# EAGLE design sanguino_better_both (EAGLE 5.10)
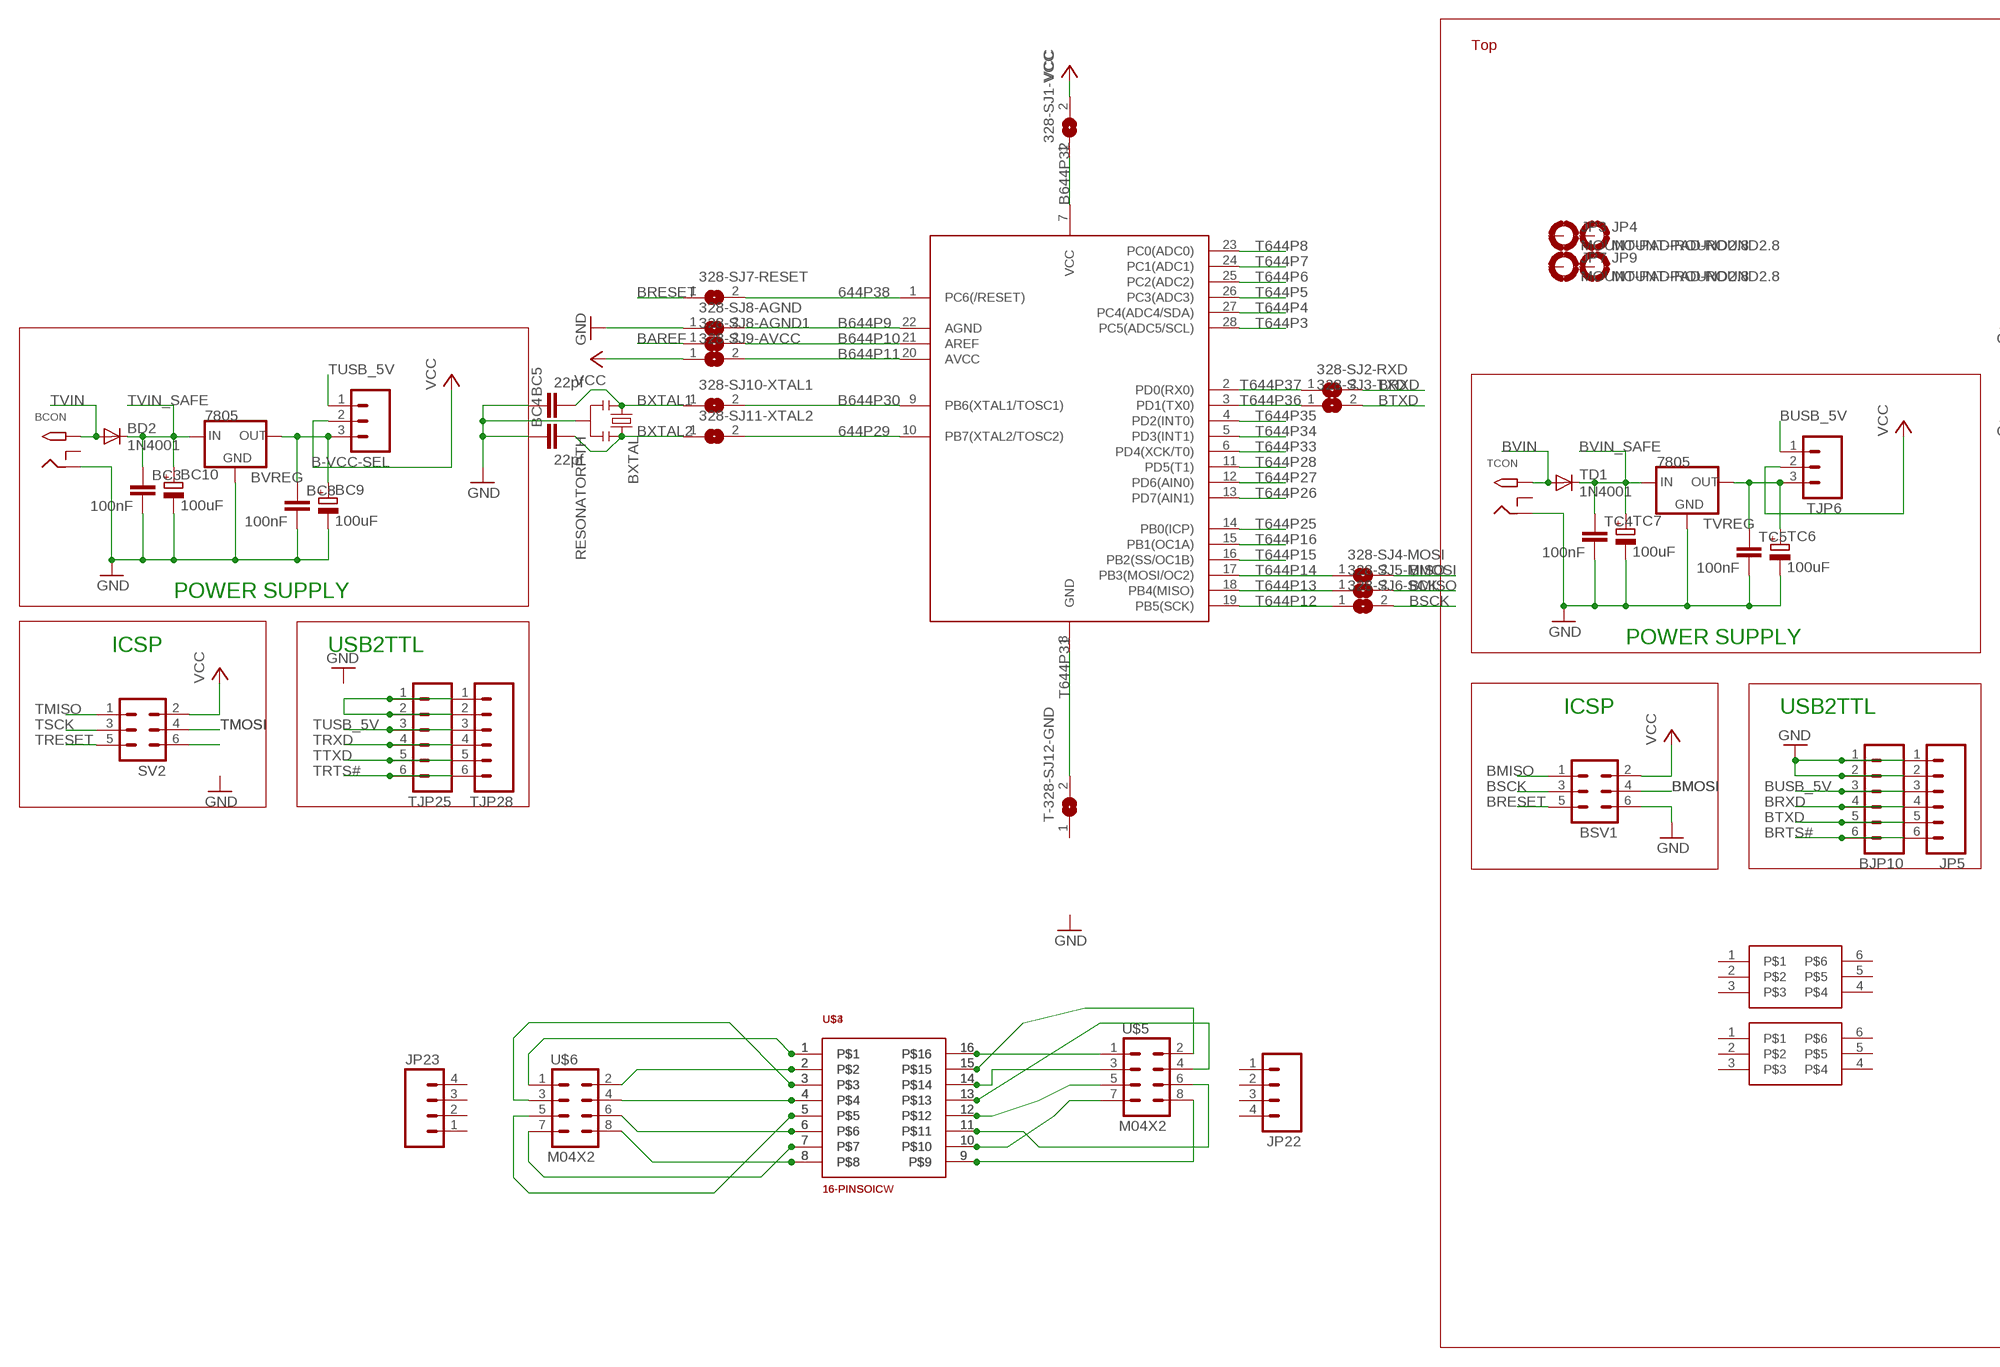
[diagram p0: schematic, sheet 1, part 1 of 2]
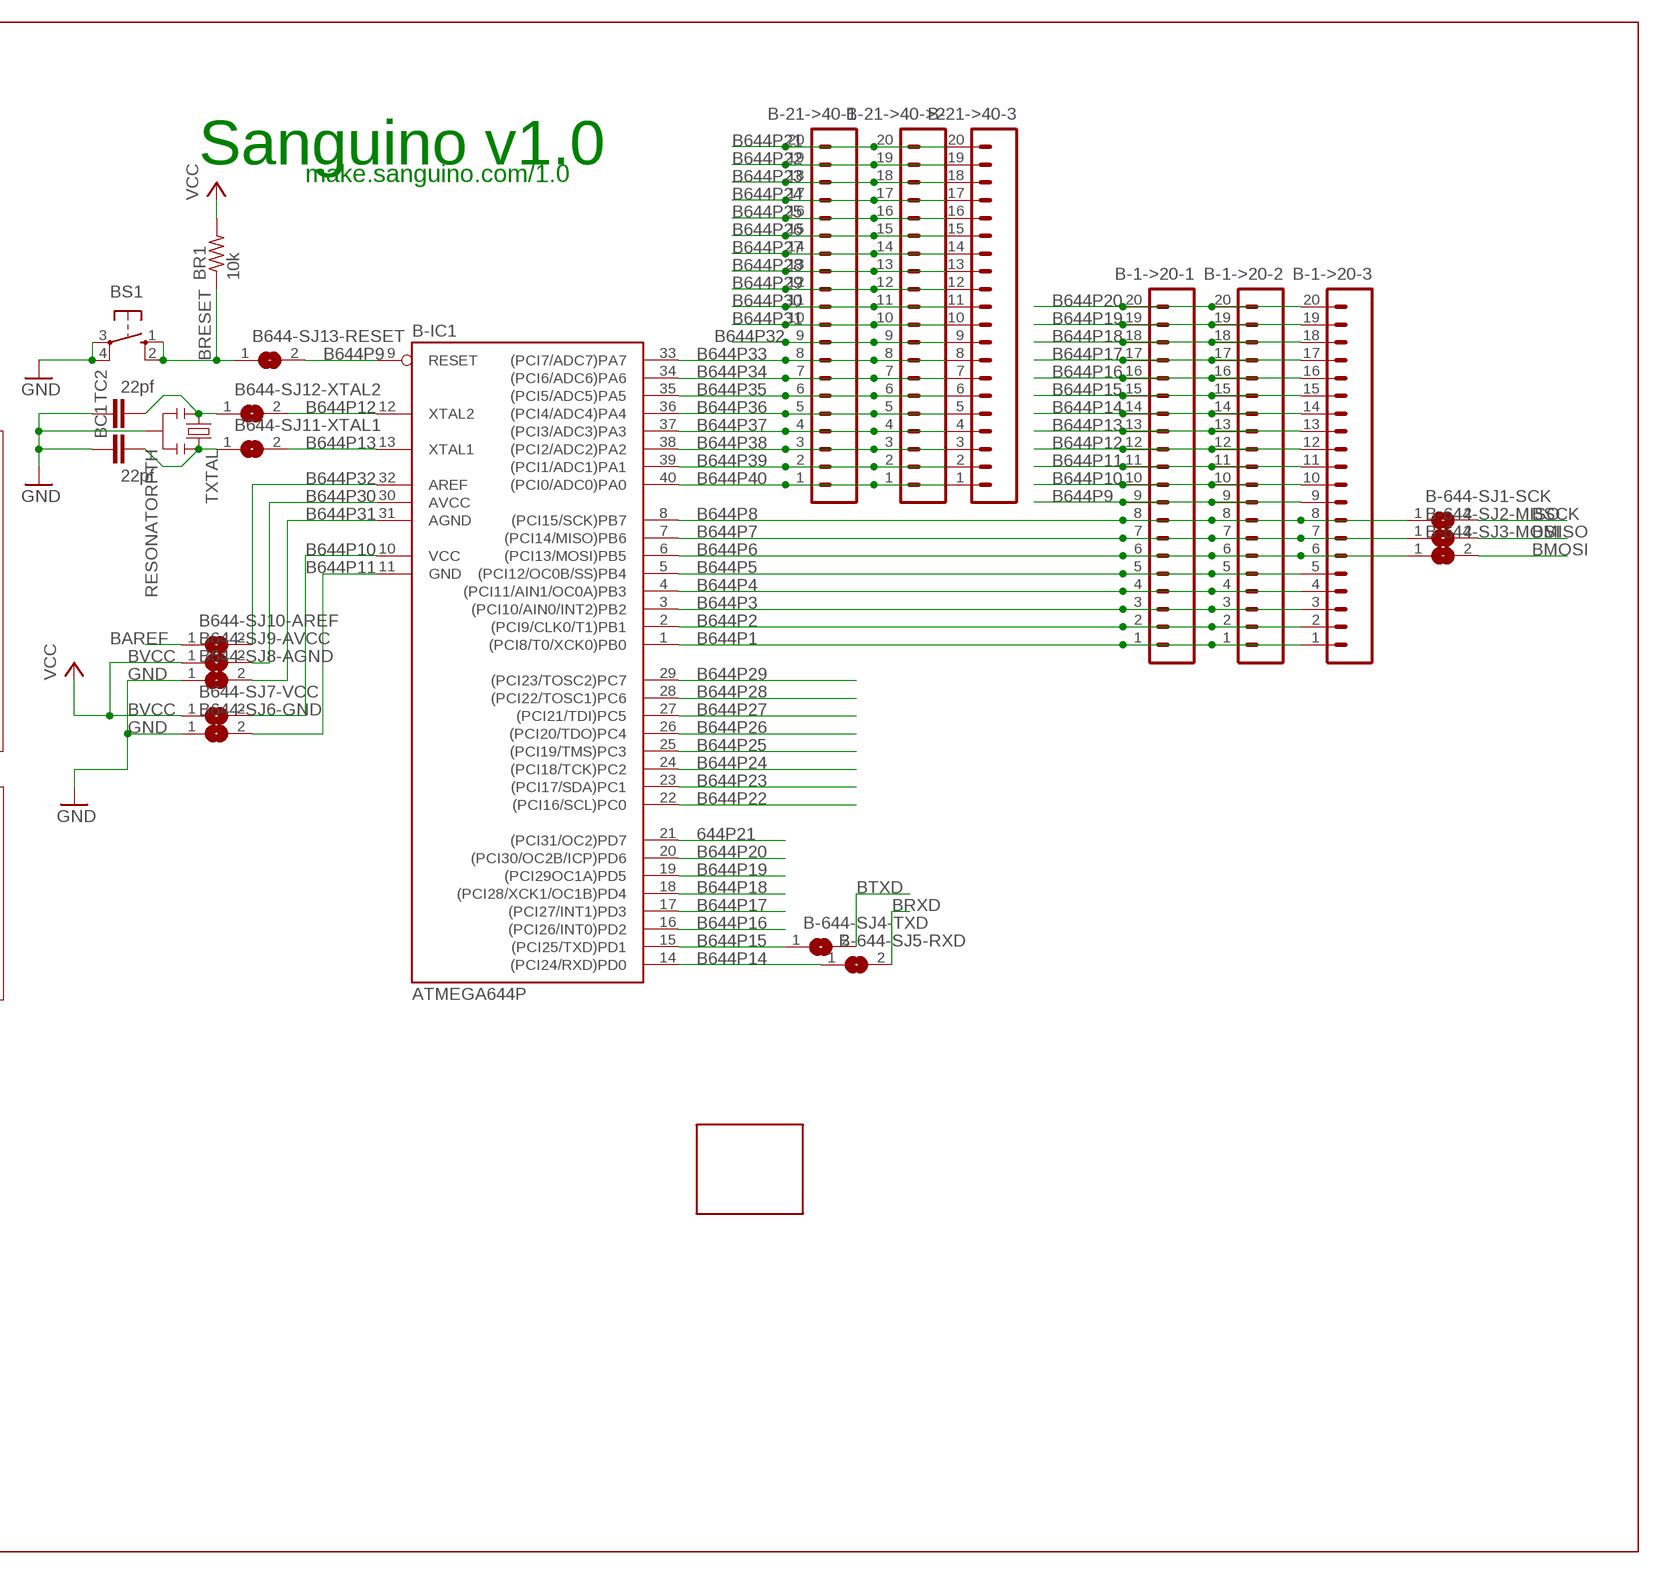
[diagram p1: schematic, sheet 1, part 2 of 2]

## Parts
328-SJ1-VCC  SJ  [SJ]
328-SJ2-RXD  SJ  [SJ]
328-SJ3-TXD  SJ  [SJ]
328-SJ4-MOSI  SJ  [SJ]
328-SJ5-MISO  SJ  [SJ]
328-SJ6-SCK  SJ  [SJ]
328-SJ7-RESET  SJ  [SJ]
328-SJ8-AGND  SJ  [SJ]
328-SJ8-AGND1  SJ  [SJ]
328-SJ9-AVCC  SJ  [SJ]
328-SJ10-XTAL1  SJ  [SJ]
328-SJ11-XTAL2  SJ  [SJ]
B644-SJ6-GND  SJ  [SJ]
B644-SJ7-VCC  SJ  [SJ]
B644-SJ8-AGND  SJ  [SJ]
B644-SJ9-AVCC  SJ  [SJ]
B644-SJ10-AREF  SJ  [SJ]
B644-SJ11-XTAL1  SJ  [SJ]
B644-SJ12-XTAL2  SJ  [SJ]
B644-SJ13-RESET  SJ  [SJ]
B-1->20-1  M20  [1X20]
B-1->20-2  M20  [1X20]
B-1->20-3  M20  [1X20]
B-21->40-1  M20  [1X20]
B-21->40-3  M20  [1X20]
B-21->40->2  M20  [1X20]
B-644-SJ1-SCK  SJ  [SJ]
B-644-SJ2-MISO  SJ  [SJ]
B-644-SJ3-MOSI  SJ  [SJ]
B-644-SJ4-TXD  SJ  [SJ]
B-644-SJ5-RXD  SJ  [SJ]
B-IC1  ATMEGA644P  ATMEGA644V-10P  [DIL40]
B-VCC-SEL  M03PTH  [1X03]
BC1  22pf  C-EU025-025X050  [C025-025X050]
BC3  100nF  C-EU050-030X075  [C050-030X075]
BC4  22pf  C-EU025-025X050  [C025-025X050]
BC5  22pf  C-EU025-025X050  [C025-025X050]
BC8  100nF  C-EU050-030X075  [C050-030X075]
BC9  100uF  CPOL-EUE2.5-6  [E2,5-6]
BC10  100uF  CPOL-EUE2.5-6  [E2,5-6]
BCON  2.1MMJACKTHM  [PJ-102A-DOUBLE_SIDED]
BD2  1N4001  1N4004  [DO41-10]
BJP10  M06SIP  [1X06]
BR1  10k  R-US_0207/2V  [0207/2V]
BS1  10-XX  [B3F-10XX]
BSV1  ML6  [ML6]
BVREG  7805  V_REG_78XXSINK  [TO220-IGO]
BXTAL  RESONATORPTH  [RESONATOR-PTH]
JP3  MOUNT-PAD-ROUND2.8  [2,8-PAD]
JP4  MOUNT-PAD-ROUND2.8  [2,8-PAD]
JP5  M06SIP  [1X06]
JP7  MOUNT-PAD-ROUND2.8  [2,8-PAD]
JP9  MOUNT-PAD-ROUND2.8  [2,8-PAD]
JP22  M04PTH  [1X04]
JP23  M04PTH  [1X04]
SV2  ML6  [ML6]
T-328-SJ12-GND  SJ  [SJ]
TC2  22pf  C-EU025-025X050  [C025-025X050]
TC4  100nF  C-EU050-030X075  [C050-030X075]
TC5  100nF  C-EU050-030X075  [C050-030X075]
TC6  100uF  CPOL-EUE2.5-6  [E2,5-6]
TC7  100uF  CPOL-EUE2.5-6  [E2,5-6]
TCON  2.1MMJACKTHM  [PJ-102A-DOUBLE_SIDED]
TD1  1N4001  1N4004  [DO41-10]
TJP6  M03PTH  [1X03]
TJP25  M06SIP  [1X06]
TJP28  M06SIP  [1X06]
TVREG  7805  V_REG_78XXSINK  [TO220-IGO]
TXTAL  RESONATORPTH  [RESONATOR-PTH]
U$2  ATMEGA328P  [DIL28-3]
U$3  16-PINSOICW  [SO16W]
U$4  16-PINSOIC  [SO16]
U$5  M04X2  [2X4]
U$6  M04X2  [2X4]
U$7  6-PINSOT23-6  [SOT23-6L]
U$8  6-PINSC70-6  [SC70-6L]
U$10  4X4-BRK-2X6-RAIL  [4X4-BRK-2X6-RAIL]

## Nets
644P21: B-IC1.21((PCI31/OC2)PD7)
644P29: 328-SJ11-XTAL2.2 U$2.10(PB7(XTAL2/TOSC2))
644P38: 328-SJ7-RESET.2 U$2.1(PC6(/RESET))
B644P1: B-1->20-1.1 B-1->20-2.1 B-1->20-3.1 B-IC1.1((PCI8/T0/XCK0)PB0)
B644P2: B-1->20-1.2 B-1->20-2.2 B-1->20-3.2 B-IC1.2((PCI9/CLK0/T1)PB1)
B644P3: B-1->20-1.3 B-1->20-2.3 B-1->20-3.3 B-IC1.3((PCI10/AIN0/INT2)PB2)
B644P4: B-1->20-1.4 B-1->20-2.4 B-1->20-3.4 B-IC1.4((PCI11/AIN1/OC0A)PB3)
B644P5: B-1->20-1.5 B-1->20-2.5 B-1->20-3.5 B-IC1.5((PCI12/OC0B/SS)PB4)
B644P6: B-1->20-1.6 B-1->20-2.6 B-1->20-3.6 B-644-SJ3-MOSI.1 B-IC1.6((PCI13/MOSI)PB5)
B644P7: B-1->20-1.7 B-1->20-2.7 B-1->20-3.7 B-644-SJ2-MISO.1 B-IC1.7((PCI14/MISO)PB6)
B644P8: B-1->20-1.8 B-1->20-2.8 B-1->20-3.8 B-644-SJ1-SCK.1 B-IC1.8((PCI15/SCK)PB7)
B644P9: 328-SJ8-AGND.2 B644-SJ13-RESET.2 B-1->20-1.9 B-1->20-2.9 B-1->20-3.9 B-IC1.9(RESET) U$2.22(AGND)
B644P10: 328-SJ8-AGND1.2 B644-SJ7-VCC.2 B-1->20-1.10 B-1->20-2.10 B-1->20-3.10 B-IC1.10(VCC) U$2.21(AREF)
B644P11 [power]: 328-SJ9-AVCC.2 B644-SJ6-GND.2 B-1->20-1.11 B-1->20-2.11 B-1->20-3.11 B-IC1.11(GND) U$2.20(AVCC)
B644P12: B644-SJ12-XTAL2.2 B-1->20-1.12 B-1->20-2.12 B-1->20-3.12 B-IC1.12(XTAL2)
B644P13: B644-SJ11-XTAL1.2 B-1->20-1.13 B-1->20-2.13 B-1->20-3.13 B-IC1.13(XTAL1)
B644P14: B-1->20-1.14 B-1->20-2.14 B-1->20-3.14 B-644-SJ5-RXD.1 B-IC1.14((PCI24/RXD)PD0)
B644P15: B-1->20-1.15 B-1->20-2.15 B-1->20-3.15 B-644-SJ4-TXD.1 B-IC1.15((PCI25/TXD)PD1)
B644P16: B-1->20-1.16 B-1->20-2.16 B-1->20-3.16 B-IC1.16((PCI26/INT0)PD2)
B644P17: B-1->20-1.17 B-1->20-2.17 B-1->20-3.17 B-IC1.17((PCI27/INT1)PD3)
B644P18: B-1->20-1.18 B-1->20-2.18 B-1->20-3.18 B-IC1.18((PCI28/XCK1/OC1B)PD4)
B644P19: B-1->20-1.19 B-1->20-2.19 B-1->20-3.19 B-IC1.19((PCI29OC1A)PD5)
B644P20: B-1->20-1.20 B-1->20-2.20 B-1->20-3.20 B-IC1.20((PCI30/OC2B/ICP)PD6)
B644P21: B-21->40-1.20 B-21->40-3.20 B-21->40->2.20
B644P22: B-21->40-1.19 B-21->40-3.19 B-21->40->2.19 B-IC1.22((PCI16/SCL)PC0)
B644P23: B-21->40-1.18 B-21->40-3.18 B-21->40->2.18 B-IC1.23((PCI17/SDA)PC1)
B644P24: B-21->40-1.17 B-21->40-3.17 B-21->40->2.17 B-IC1.24((PCI18/TCK)PC2)
B644P25: B-21->40-1.16 B-21->40-3.16 B-21->40->2.16 B-IC1.25((PCI19/TMS)PC3)
B644P26: B-21->40-1.15 B-21->40-3.15 B-21->40->2.15 B-IC1.26((PCI20/TDO)PC4)
B644P27: B-21->40-1.14 B-21->40-3.14 B-21->40->2.14 B-IC1.27((PCI21/TDI)PC5)
B644P28: B-21->40-1.13 B-21->40-3.13 B-21->40->2.13 B-IC1.28((PCI22/TOSC1)PC6)
B644P29: B-21->40-1.12 B-21->40-3.12 B-21->40->2.12 B-IC1.29((PCI23/TOSC2)PC7)
B644P30: 328-SJ10-XTAL1.2 B644-SJ9-AVCC.2 B-21->40-1.11 B-21->40-3.11 B-21->40->2.11 B-IC1.30(AVCC) U$2.9(PB6(XTAL1/TOSC1))
B644P31: B644-SJ8-AGND.2 B-21->40-1.10 B-21->40-3.10 B-21->40->2.10 B-IC1.31(AGND)
B644P32: 328-SJ1-VCC.1 B644-SJ10-AREF.2 B-21->40-1.9 B-21->40-3.9 B-21->40->2.9 B-IC1.32(AREF) U$2.7(VCC)
B644P33: B-21->40-1.8 B-21->40-3.8 B-21->40->2.8 B-IC1.33((PCI7/ADC7)PA7)
B644P34: B-21->40-1.7 B-21->40-3.7 B-21->40->2.7 B-IC1.34((PCI6/ADC6)PA6)
B644P35: B-21->40-1.6 B-21->40-3.6 B-21->40->2.6 B-IC1.35((PCI5/ADC5)PA5)
B644P36: B-21->40-1.5 B-21->40-3.5 B-21->40->2.5 B-IC1.36((PCI4/ADC4)PA4)
B644P37: B-21->40-1.4 B-21->40-3.4 B-21->40->2.4 B-IC1.37((PCI3/ADC3)PA3)
B644P38: B-21->40-1.3 B-21->40-3.3 B-21->40->2.3 B-IC1.38((PCI2/ADC2)PA2)
B644P39: B-21->40-1.2 B-21->40-3.2 B-21->40->2.2 B-IC1.39((PCI1/ADC1)PA1)
B644P40: B-21->40-1.1 B-21->40-3.1 B-21->40->2.1 B-IC1.40((PCI0/ADC0)PA0)
BAREF: 328-SJ8-AGND1.1 B644-SJ10-AREF.1
BMISO: 328-SJ5-MISO.2 B-644-SJ2-MISO.2 BSV1.1
BMOSI: 328-SJ4-MOSI.2 B-644-SJ3-MOSI.2 BSV1.4
BRESET: 328-SJ7-RESET.1 B644-SJ13-RESET.1 BR1.1 BS1.1(S) BS1.2(S1) BSV1.5
BRTS#: BJP10.6 JP5.6
BRXD: 328-SJ2-RXD.2 B-644-SJ5-RXD.2 BJP10.4 JP5.4
BSCK: 328-SJ6-SCK.2 B-644-SJ1-SCK.2 BSV1.3
BTXD: 328-SJ3-TXD.2 B-644-SJ4-TXD.2 BJP10.5 JP5.5
BUSB_5V: BJP10.3 JP5.3 TJP6.1
BVCC [power]: 328-SJ1-VCC.2 328-SJ9-AVCC.1 B644-SJ7-VCC.1 B644-SJ9-AVCC.1 BR1.2 BSV1.2 TJP6.2 ; supply symbol labelled VCC
BVIN [power]: TCON.TIP TD1.A
BVIN_SAFE [power]: TC4.1 TC7.+ TD1.C TVREG.IN
BVREG-OUT: TC5.1 TC6.+ TJP6.3 TVREG.OUT
BXTAL1: 328-SJ10-XTAL1.1
BXTAL2: 328-SJ11-XTAL2.1 BC4.2 BXTAL.3
GND: 328-SJ8-AGND.1 B644-SJ6-GND.1 B644-SJ8-AGND.1 BC1.1 BC4.1 BC5.1 BJP10.1 BJP10.2 BS1.3(P) BS1.4(P1) BSV1.6 BXTAL.2 JP5.1 JP5.2 TC2.1 TC4.2 TC5.2 TC6.- TC7.- TCON.RING TVREG.GND TXTAL.2
N$11: U$3.16 U$4.16 U$5.1
N$12: U$3.15 U$4.15 U$5.2
N$14: U$3.5 U$4.5 U$6.5
N$15: U$3.1 U$4.1 U$6.1
N$21: U$3.14 U$4.14 U$5.3
N$22: U$3.13 U$4.13 U$5.4
N$23: U$3.12 U$4.12 U$5.5
N$24: U$3.11 U$4.11 U$5.6
N$25: U$3.10 U$4.10 U$5.7
N$26: U$3.9 U$4.9 U$5.8
N$27: U$3.8 U$4.8 U$6.8
N$28: U$3.7 U$4.7 U$6.7
N$29: U$3.6 U$4.6 U$6.6
N$31: U$3.4 U$4.4 U$6.4
N$32: U$3.3 U$4.3 U$6.3
N$33: U$3.2 U$4.2 U$6.2
T644P3: U$2.28(PC5(ADC5/SCL))
T644P4: U$2.27(PC4(ADC4/SDA))
T644P5: U$2.26(PC3(ADC3))
T644P6: U$2.25(PC2(ADC2))
T644P7: U$2.24(PC1(ADC1))
T644P8: U$2.23(PC0(ADC0))
T644P12: 328-SJ6-SCK.1 U$2.19(PB5(SCK))
T644P13: 328-SJ5-MISO.1 U$2.18(PB4(MISO))
T644P14: 328-SJ4-MOSI.1 U$2.17(PB3(MOSI/OC2))
T644P15: U$2.16(PB2(SS/OC1B))
T644P16: U$2.15(PB1(OC1A))
T644P25: U$2.14(PB0(ICP))
T644P26: U$2.13(PD7(AIN1))
T644P27: U$2.12(PD6(AIN0))
T644P28: U$2.11(PD5(T1))
T644P31: T-328-SJ12-GND.2 U$2.8(GND)
T644P33: U$2.6(PD4(XCK/T0))
T644P34: U$2.5(PD3(INT1))
T644P35: U$2.4(PD2(INT0))
T644P36: 328-SJ3-TXD.1 U$2.3(PD1(TX0))
T644P37: 328-SJ2-RXD.1 U$2.2(PD0(RX0))
TGND: BC3.2 BC8.2 BC9.- BC10.- BCON.RING BVREG.GND SV2.6 TJP25.1 TJP25.2 TJP28.1 TJP28.2 ; supply symbol labelled GND
TMISO: SV2.1
TMOSI: SV2.4
TRESET: SV2.5
TRTS#: TJP25.6 TJP28.6
TRXD: TJP25.4 TJP28.4
TSCK: SV2.3
TTXD: TJP25.5 TJP28.5
TUSB_5V: B-VCC-SEL.1 TJP25.3 TJP28.3
TVCC [power]: B-VCC-SEL.2 SV2.2 ; supply symbol labelled VCC
TVIN [power]: BCON.TIP BD2.A
TVIN_SAFE [power]: BC3.1 BC10.+ BD2.C BVREG.IN
TXTAL1: B644-SJ11-XTAL1.1 BC1.2 TXTAL.3
TXTAL2: B644-SJ12-XTAL2.1 TC2.2 TXTAL.1
VREG-OUT2: B-VCC-SEL.3 BC8.1 BC9.+ BVREG.OUT
XTAL2: BC5.2 BXTAL.1
Unconnected: BCON.RING_SW JP3.B2,8(MOUNT) JP4.B2,8(MOUNT) JP7.B2,8(MOUNT) JP9.B2,8(MOUNT) JP22.1 JP22.2 JP22.3 JP22.4 JP23.1 JP23.2 JP23.3 JP23.4 T-328-SJ12-GND.1 TCON.RING_SW U$7.1 U$7.2 U$7.3 U$7.4 U$7.5 U$7.6 U$8.1 U$8.2 U$8.3 U$8.4 U$8.5 U$8.6

## Notes on the sheet
- Top
- Sanguino v1.0
- make.sanguino.com/1.0
- POWER SUPPLY
- POWER SUPPLY
- ICSP | USB2TTL
- ICSP | USB2TTL

## Library data of the parts
328-SJ1-VCC 328-SJ2-RXD 328-SJ3-TXD 328-SJ4-MOSI 328-SJ5-MISO 328-SJ6-SCK 328-SJ7-RESET 328-SJ8-AGND 328-SJ8-AGND1 328-SJ9-AVCC 328-SJ10-XTAL1 328-SJ11-XTAL2 B644-SJ6-GND B644-SJ7-VCC B644-SJ8-AGND B644-SJ9-AVCC B644-SJ10-AREF B644-SJ11-XTAL1 B644-SJ12-XTAL2 B644-SJ13-RESET B-644-SJ1-SCK B-644-SJ2-MISO B-644-SJ3-MOSI B-644-SJ4-TXD B-644-SJ5-RXD T-328-SJ12-GND = ideabot:SJ: SMD solder JUMPER
B-1->20-1-B-1->20-3 B-21->40-1 B-21->40-3 B-21->40->2 = SparkFun:M20: This is just like the LOCK variant in that the holes are staggared by 5 mil, but except for the last two holes. They are not altered from the "standard" footprint layout. This is used for a special purpose on the layout of our Graphic LCD Backpack. Make sure you want to use this device before selecting it for you project!
B-IC1 = avr:ATMEGA644*P: MICROCONTROLLER 64 kBytes FLASH 4 kBytes SRAM 2 kBytes EEPROM DUAL USART 8-channel 10 bit ADC
B-VCC-SEL TJP6 = SparkFun:M03: Header 3 Standard 3-pin 0.1" header. Use with straight break away headers (SKU : PRT-00116), right angle break away headers (PRT-00553), swiss pins (PRT-00743), machine pins (PRT-00117), and female headers (PRT-00115). Molex polarized connector foot print use with SKU : PRT-08232 with associated crimp pins and housings.
BC1 BC3-BC5 BC8 TC2 TC4 TC5 = rcl:C-EU: CAPACITOR, European symbol
BC9 BC10 TC6 TC7 = rcl:CPOL-EU: POLARIZED CAPACITOR, European symbol
BCON TCON = ideabot:2.1MMJACK: 2.1mm x 5.5mm THM DC jack with internal switch. Digikey part #PJ-102A, 4UCON part #05537 2.1mm x 5.5mm SMT DC jack with internal switch. Digikey part #PJ-002A-SMT, 4UCON part #03267 By microbuilder.eu & adafruit.com
BD2 TD1 = diode:1N4004: DIODE general purpose rectifier, 1 A
BJP10 JP5 TJP25 TJP28 = SparkFun:M06: Header 6 Standard 6-pin 0.1" header. Use with straight break away headers (SKU : PRT-00116), right angle break away headers (PRT-00553), swiss pins (PRT-00743), machine pins (PRT-00117), and female headers (PRT-00115). Molex polarized connector foot print use with SKU : PRT-08094 with associated crimp pins and housings. NOTES ON THE VARIANTS LOCK and LOCK_LONGPADS... This footprint was designed to help hold the alignment of a through-hole component (i.e. 6-pin header) while soldering it into place. You may notice that each hole has been shifted either up or down by 0.005 of an inch from it's more standard position (which is a perfectly straight line). This slight alteration caused the pins (the squares in the middle) to touch the edges of the holes. Because they are alternating, it causes a "brace" to hold the component in place. 0.005 has proven to be the perfect amount of "off-center" position when using our standard breakaway headers. Although looks a little odd when you look at the bare footprint, once you have a header in there, the alteration is very hard to notice. Also, if you push a header all the way into place, it is covered up entirely on the bottom side. This idea of altering the position of holes to aid alignment will be further integrated into the Sparkfun Library for other footprints. It can help hold any component with 3 or more connection pins.
BR1 = adafruit:R-US_: RESISTOR, American symbol
BS1 = switch-omron:10-XX: OMRON SWITCH
BSV1 SV2 = con-harting-ml:ML6: HARTING
BVREG TVREG = SparkFun:V_REG_78XX: Voltage Regulator Standard 7805 5V regulator. IGO (Input Ground Output). Spark Fun Electronics SKU : COM-00107
BXTAL TXTAL = SparkFun:RESONATOR: Resonator Small SMD resonator. This is the itty bitty 10/20MHz resonators with built in caps. CSTCE10M0G55 and CSTCE20M0V53. Footprint has been reviewed closely but hasn't been tested yet.
JP3 JP4 JP7 JP9 = holes:MOUNT-PAD-ROUND: MOUNTING PAD, round
JP22 JP23 = SparkFun:M04: Header 4 Standard 4-pin 0.1" header. Use with straight break away headers (SKU : PRT-00116), right angle break away headers (PRT-00553), swiss pins (PRT-00743), machine pins (PRT-00117), and female headers (PRT-00115). Molex polarized connector foot print use with SKU : PRT-08231 with associated crimp pins and housings. 1MM SMD Version SKU: PRT-10208
U$2 = ideabot:ATMEGA328P
U$3 U$4 = ideabot:16-PIN
U$5 U$6 = SparkFun:M04X2
U$7 U$8 = ideabot:6-PIN
U$10 = ideabot:4X4-BRK-2X6-RAIL

## Net classes
0 default: width 0.254 mm, clearance 0.152 mm
1 power: width 0.305 mm, clearance 0.152 mm

## Board
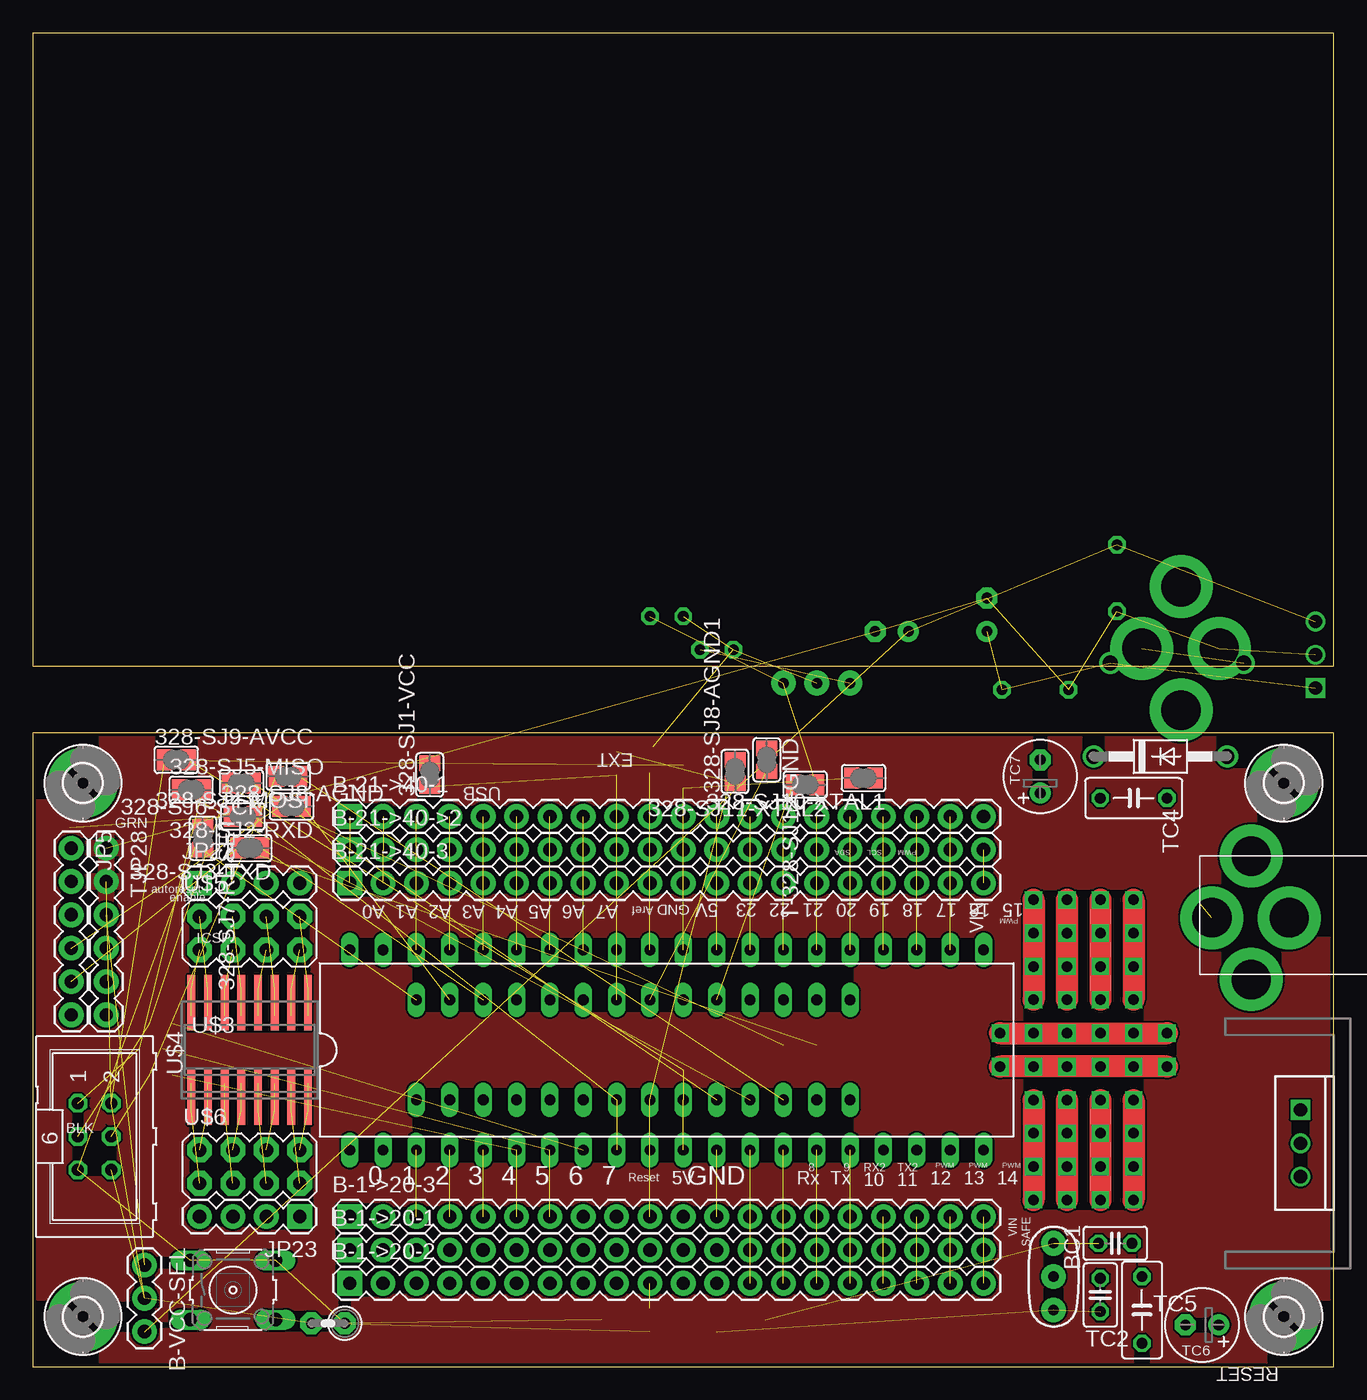
[diagram p2: board, top side]
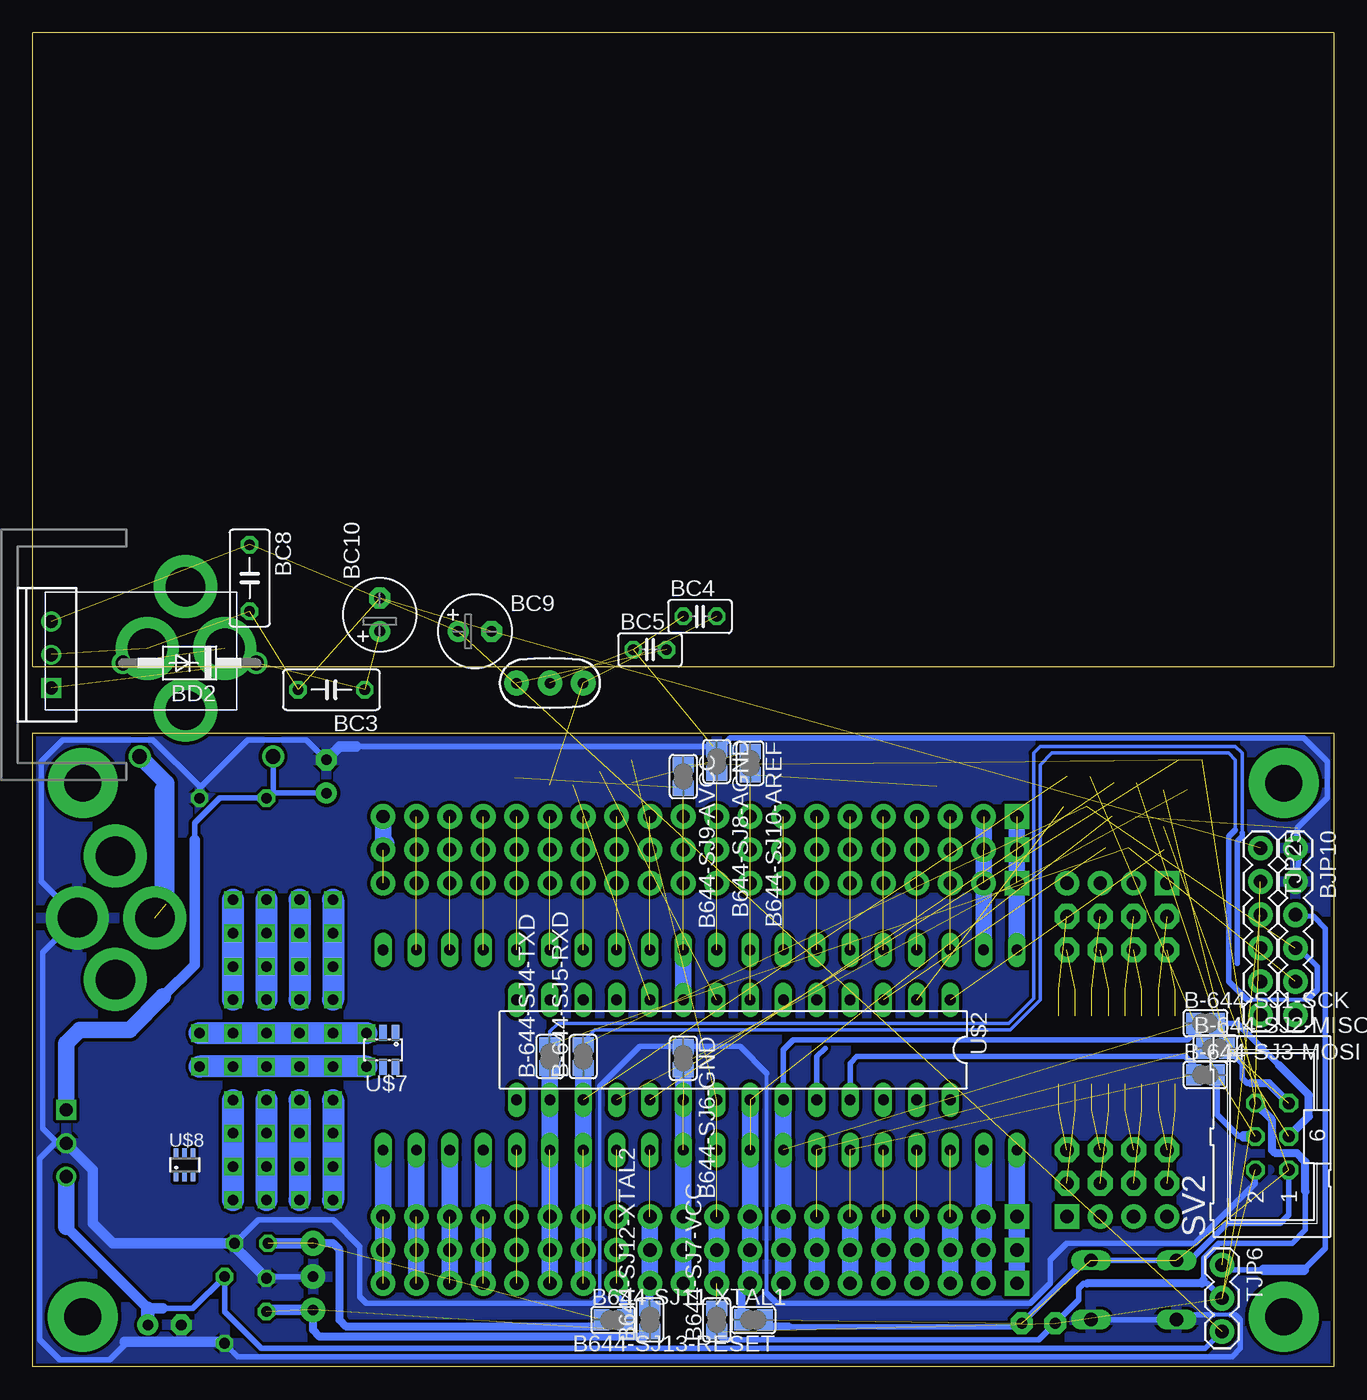
[diagram p3: board, bottom side, seen from below]

Size 99.06 x 101.6 mm. Coordinates in mm from the lower left corner, seen from the top.
Outline: 0,0 99.06,0 99.06,48.26 0,48.26 0,0
Outline: 99.06,53.34 0,53.34 0,101.6 99.06,101.6 99.06,53.34
Copper layers (1*16): Top 0.035mm / dielectric 1.5mm / Bottom 0.035mm
Design rules "Fusion_eagle_rule_v1.1 *": minimum track width 6mil, minimum drill 12mil, track to track 6mil, track to pad 6mil, pad to pad 6mil, via to via 6mil, smd to smd 0mil, copper to edge 10mil, drill to drill 10mil, minimum pad ring 10mil, minimum via ring 6mil, stop-mask expansion 2mil, vias tented up to drill 100mil, thermal gap 10mil

### Footprints (pad centres in the part's own frame; a part is rotated, then mirrored left to right if it is on the bottom)
SJ = smd 1.168 x 1.6: 1 -0.889,0; 2 0.889,0
1X20 = drill 1.016 pad 1.88 square: 1 0,0 | drill 1.016 pad 1.88 round: 2 2.54,0; 3 5.08,0; 4 7.62,0; 5 10.16,0; 6 12.7,0; 7 15.24,0; 8 17.78,0; 9 20.32,0; 10 22.86,0; 11 25.4,0; 12 27.94,0; 13 30.48,0; 14 33.02,0; 15 35.56,0; 16 38.1,0; 17 40.64,0; 18 43.18,0; 19 45.72,0; 20 48.26,0
DIL40 = drill 0.813 long: 1 -24.13,-7.62; 2 -21.59,-7.62; 3 -19.05,-7.62; 4 -16.51,-7.62; 5 -13.97,-7.62; 6 -11.43,-7.62; 7 -8.89,-7.62; 8 -6.35,-7.62; 9 -3.81,-7.62; 10 -1.27,-7.62; 11 1.27,-7.62; 12 3.81,-7.62; 13 6.35,-7.62; 14 8.89,-7.62; 15 11.43,-7.62; 16 13.97,-7.62; 17 16.51,-7.62; 18 19.05,-7.62; 19 21.59,-7.62; 20 24.13,-7.62; 21 24.13,7.62; 22 21.59,7.62; 23 19.05,7.62; 24 16.51,7.62; 25 13.97,7.62; 26 11.43,7.62; 27 8.89,7.62; 28 6.35,7.62; 29 3.81,7.62; 30 1.27,7.62; 31 -1.27,7.62; 32 -3.81,7.62; 33 -6.35,7.62; 34 -8.89,7.62; 35 -11.43,7.62; 36 -13.97,7.62; 37 -16.51,7.62; 38 -19.05,7.62; 39 -21.59,7.62; 40 -24.13,7.62
1X03 = drill 1.016 pad 1.88 round: 1 0,0; 2 2.54,0; 3 5.08,0
C025-025X050 = drill 0.813 octagon: 1 -1.27,0; 2 1.27,0
C050-030X075 = drill 0.813 octagon: 1 -2.54,0; 2 2.54,0
E2,5-6 = drill 0.813 pad 1.6 round: + -1.27,0 | drill 0.813 pad 1.6 octagon: - 1.27,0
PJ-102A-DOUBLE_SIDED = drill 3 pad 4.8 round: RING 0.1,-3.39; RING_SW -4.6,-6.29; RING_SW1 4.8,-6.29; TIP 0.1,-9.29
DO41-10 = drill 1.118 round: A 5.08,0; C -5.08,0
1X06 = drill 1.016 pad 1.88 round: 1 0,0; 2 2.54,0; 3 5.08,0; 4 7.62,0; 5 10.16,0; 6 12.7,0
0207/2V = drill 0.813 pad 1.676 octagon: 1 -1.27,0; 2 1.27,0
B3F-10XX = drill 1.016 long: 1 -3.251,2.261; 2 3.251,2.261; 3 -3.251,-2.261; 4 3.251,-2.261
ML6 = drill 0.914 octagon: 1 -2.54,-1.27; 2 -2.54,1.27; 3 0,-1.27; 4 0,1.27; 5 2.54,-1.27; 6 2.54,1.27
TO220-IGO = drill 1 round: GND 0,0; OUT 2.54,0 | drill 1 square: IN -2.54,0
RESONATOR-PTH = drill 0.8 pad 1.88 round: 1 -2.54,0; 2 0,0; 3 2.54,0
2,8-PAD = drill 2.8 pad 5.334 round: B2,8 0,0
1X04 = drill 1.016 pad 1.88 square: 1 0,0 | drill 1.016 pad 1.88 round: 2 2.54,0; 3 5.08,0; 4 7.62,0
DIL28-3 = drill 0.813 long: 1 -16.51,-3.81; 2 -13.97,-3.81; 3 -11.43,-3.81; 4 -8.89,-3.81; 5 -6.35,-3.81; 6 -3.81,-3.81; 7 -1.27,-3.81; 8 1.27,-3.81; 9 3.81,-3.81; 10 6.35,-3.81; 11 8.89,-3.81; 12 11.43,-3.81; 13 13.97,-3.81; 14 16.51,-3.81; 15 16.51,3.81; 16 13.97,3.81; 17 11.43,3.81; 18 8.89,3.81; 19 6.35,3.81; 20 3.81,3.81; 21 1.27,3.81; 22 -1.27,3.81; 23 -3.81,3.81; 24 -6.35,3.81; 25 -8.89,3.81; 26 -11.43,3.81; 27 -13.97,3.81; 28 -16.51,3.81
SO16W = smd 0.6 x 2.2: 1 -4.445,-4.6; 2 -3.175,-4.6; 3 -1.905,-4.6; 4 -0.635,-4.6; 5 0.635,-4.6; 6 1.905,-4.6; 7 3.175,-4.6; 8 4.445,-4.6; 9 4.445,4.6; 10 3.175,4.6; 11 1.905,4.6; 12 0.635,4.6; 13 -0.635,4.6; 14 -1.905,4.6; 15 -3.175,4.6; 16 -4.445,4.6
SO16 = smd 0.6 x 2.2: 1 -4.445,-2.6; 2 -3.175,-2.6; 3 -1.905,-2.6; 4 -0.635,-2.6; 5 0.635,-2.6; 6 1.905,-2.6; 7 3.175,-2.6; 8 4.445,-2.6; 9 4.445,2.6; 10 3.175,2.6; 11 1.905,2.6; 12 0.635,2.6; 13 -0.635,2.6; 14 -1.905,2.6; 15 -3.175,2.6; 16 -4.445,2.6
2X4 = drill 1.016 pad 1.88 octagon: 1 -3.81,-1.27; 2 -3.81,1.27; 3 -1.27,-1.27; 4 -1.27,1.27; 5 1.27,-1.27; 6 1.27,1.27; 7 3.81,-1.27; 8 3.81,1.27
SOT23-6L = smd 0.55 x 1.2: 1 -0.95,-1.3; 2 0,-1.3; 3 0.95,-1.3; 4 0.95,1.3; 5 0,1.3; 6 -0.95,1.3
SC70-6L = smd 0.35 x 0.8: 1 -0.65,-0.85; 2 0,-0.85; 3 0.65,-0.85; 4 0.65,0.85; 5 0,0.85; 6 -0.65,0.85
4X4-BRK-2X6-RAIL = drill 0.8 square: P$1 -7.62,0; P$2 -5.08,0; P$3 -2.54,0; P$4 0,0; P$5 2.54,0; P$6 5.08,0; P$7 -7.62,-2.54; P$8 -5.08,-2.54; P$9 -2.54,-2.54; P$10 0,-2.54; P$11 2.54,-2.54; P$12 5.08,-2.54; P$13 -5.08,2.54; P$14 -5.08,5.08; P$15 -5.08,7.62; P$16 -5.08,10.16; P$17 -2.54,2.54; P$18 -2.54,5.08; P$19 -2.54,7.62; P$20 -2.54,10.16; P$21 0,2.54; P$22 0,5.08; P$23 0,7.62; P$24 0,10.16; P$25 2.54,2.54; P$26 2.54,5.08; P$27 2.54,7.62; P$28 2.54,10.16; P$29 -5.08,-5.08; P$30 -5.08,-7.62; P$31 -5.08,-10.16; P$32 -5.08,-12.7; P$33 -2.54,-5.08; P$34 -2.54,-7.62; P$35 -2.54,-10.16; P$36 -2.54,-12.7; P$37 0,-5.08; P$38 0,-7.62; P$39 0,-10.16; P$40 0,-12.7; P$41 2.54,-5.08; P$42 2.54,-7.62; P$43 2.54,-10.16; P$44 2.54,-12.7

### Placement (x,y rotation side)
328-SJ1-VCC  30.23,45.09 90 top
328-SJ2-RXD  19.68,42.67 180 top
328-SJ3-TXD  16.51,39.5 180 top
328-SJ4-MOSI  19.43,44.96 180 top
328-SJ5-MISO  12.06,43.94 0 top
328-SJ6-SCK  15.88,44.45 180 top
328-SJ7-RESET  12.95,40.26 270 top
328-SJ8-AGND  16,41.91 0 top
328-SJ8-AGND1  53.47,45.34 90 top
328-SJ9-AVCC  10.92,46.23 0 top
328-SJ10-XTAL1  63.25,44.83 180 top
328-SJ11-XTAL2  58.8,44.32 180 top
B644-SJ6-GND  49.53,23.5 270 bottom
B644-SJ7-VCC  46.99,3.56 90 bottom
B644-SJ8-AGND  46.99,46.1 270 bottom
B644-SJ9-AVCC  49.53,44.96 270 bottom
B644-SJ10-AREF  44.45,45.97 270 bottom
B644-SJ11-XTAL1  54.86,3.56 0 bottom
B644-SJ12-XTAL2  52.07,3.56 90 bottom
B644-SJ13-RESET  44.2,3.56 180 bottom
B-1->20-1  24.13,8.89 0 top
B-1->20-2  24.13,6.35 0 top
B-1->20-3  24.13,11.43 0 top
B-21->40-1  24.13,41.91 0 top
B-21->40-3  24.13,36.83 0 top
B-21->40->2  24.13,39.37 0 top
B-644-SJ1-SCK  9.78,26.16 0 bottom
B-644-SJ2-MISO  9.02,24.26 0 bottom
B-644-SJ3-MOSI  9.78,22.23 0 bottom
B-644-SJ4-TXD  59.69,23.62 90 bottom
B-644-SJ5-RXD  57.15,23.62 90 bottom
B-IC1  48.26,24.13 0 top
B-VCC-SEL  8.51,7.75 270 top
BC1  82.42,9.4 180 top
BC3  76.33,51.56 180 bottom
BC4  48.26,57.15 0 bottom
BC5  52.07,54.61 0 bottom
BC8  82.55,60.07 270 bottom
BC9  65.41,56.01 0 bottom
BC10  72.64,57.28 90 bottom
BCON  93.73,54.61 90 bottom
BD2  87.12,53.59 180 bottom
BJP10  2.92,39.5 270 bottom
BR1  22.48,3.3 180 top
BS1  15.24,5.84 0 top
BSV1  4.7,17.53 270 top
BVREG  97.66,54.23 90 bottom
BXTAL  59.69,52.07 0 bottom
JP3  3.81,3.81 0 top
JP4  95.25,3.81 0 top
JP5  2.92,39.5 270 top
JP7  3.81,44.45 0 top
JP9  95.25,44.45 0 top
JP22  12.7,36.83 0 top
JP23  20.32,11.43 180 top
SV2  4.7,17.53 90 bottom
T-328-SJ12-GND  55.88,46.23 270 top
TC2  81.28,5.46 270 top
TC4  83.82,43.31 0 top
TC5  84.45,4.32 270 top
TC6  89.03,3.17 180 top
TC7  76.71,44.96 90 top
TCON  99.06,34.29 270 top
TD1  85.85,46.48 0 top
TJP6  8.51,7.75 270 bottom
TJP25  5.59,39.5 270 bottom
TJP28  5.59,39.5 270 top
TVREG  96.52,17.02 270 top
TXTAL  77.72,6.86 90 top
U$2  45.72,24.13 180 bottom
U$3  16.51,24.13 0 top
U$4  16.51,24.13 0 top
U$5  16.51,33.02 0 top
U$6  16.51,15.24 0 top
U$7  72.39,24.13 180 bottom
U$8  87.5,15.37 0 bottom
U$10  81.28,25.4 0 top

### Tracks (layer width: path | path; a pad name or v marks a point on that pad's centre or on a via)
644P29  (1 unrouted)
644P38  (1 unrouted)
644P52
  Bottom 0.406: 41.91,20.32 41.91,24.13 41.15,24.89 11.18,24.89 10.67,25.4 10.67,26.16
  Bottom 1.27: 41.91,20.32 41.91,16.51
B644P1
  Bottom 1.27: B-1->20-2.1 B-1->20-1.1 B-1->20-3.1 B-IC1.1
B644P2
  Bottom 1.27: B-1->20-2.2 B-1->20-1.2 B-1->20-3.2 B-IC1.2
B644P3  (1 unrouted)
  Bottom 1.27: B-1->20-2.3 B-1->20-1.3 B-1->20-3.3
B644P4  (1 unrouted)
  Bottom 1.27: B-1->20-2.4 B-1->20-1.4 B-1->20-3.4
B644P5  (1 unrouted)
  Bottom 1.27: B-1->20-2.5 B-1->20-1.5 B-1->20-3.5
B644P6  (2 unrouted)
  Bottom 1.27: B-1->20-2.6 B-1->20-1.6 B-1->20-3.6
B644P7  (2 unrouted)
  Bottom 1.27: B-1->20-2.7 B-1->20-1.7 B-1->20-3.7
B644P8  (1 unrouted)
  Bottom 1.27: B-1->20-2.8 B-1->20-1.8 B-1->20-3.8 B-IC1.8
B644P9  (2 unrouted)
  Bottom 0.61: B644-SJ13-RESET.2 45.09,5.71 B-1->20-2.9
  Bottom 1.27: B-1->20-2.9 B-1->20-1.9 B-1->20-3.9 U$2.22
B644P10  (4 unrouted)
  Bottom 1.27: B-1->20-2.10 B-1->20-1.10 B-1->20-3.10
B644P11  (3 unrouted)
  Bottom 1.27: B-1->20-2.11 B-1->20-1.11 B-1->20-3.11 B644-SJ6-GND.2
B644P12  (1 unrouted)
  Bottom 0.61: B644-SJ12-XTAL2.2 B-1->20-2.12
  Bottom 1.27: B-1->20-2.12 B-1->20-1.12 B-1->20-3.12
B644P13  (3 unrouted)
  Bottom 0.406: 54.61,6.22 54.61,5.46 53.98,4.83 B644-SJ11-XTAL1.2
  Bottom 0.61: 54.61,6.22 B-1->20-2.13
B644P14  (3 unrouted)
  Bottom 1.27: B-1->20-2.14 B-644-SJ5-RXD.1
B644P15  (3 unrouted)
  Bottom 1.27: B-1->20-2.15 B-644-SJ4-TXD.1
B644P16  (3 unrouted)
B644P17  (2 unrouted)
  Bottom 1.27: B-1->20-2.17 B-IC1.17
B644P18  (2 unrouted)
  Bottom 1.27: B-1->20-2.18 B-IC1.18
B644P19  (2 unrouted)
  Bottom 1.27: B-1->20-2.19 B-IC1.19
B644P20  (2 unrouted)
  Bottom 1.27: B-1->20-2.20 B-IC1.20
B644P21  (1 unrouted)
  Bottom 1.27: 72.39,39.62 B-21->40->2.20 72.14,39.62 72.14,39.88 72.39,39.62 | 72.39,39.62 B-21->40-1.20
B644P22  (3 unrouted)
B644P23  (3 unrouted)
B644P24  (3 unrouted)
B644P25  (3 unrouted)
B644P26  (3 unrouted)
B644P27  (3 unrouted)
B644P28  (3 unrouted)
B644P29  (3 unrouted)
B644P30  (6 unrouted)
  Bottom 0.305: 49.53,32.38 49.53,32.51
  Bottom 1.27: U$2.9 49.53,32.38
B644P31  (4 unrouted)
B644P32  (6 unrouted)
B644P33  (3 unrouted)
B644P34  (3 unrouted)
B644P35  (3 unrouted)
B644P36  (3 unrouted)
B644P37  (3 unrouted)
B644P38  (3 unrouted)
B644P39  (2 unrouted)
  Bottom 1.27: B-IC1.39 B-21->40-1.2
B644P40  (2 unrouted)
  Bottom 1.27: B-IC1.40 B-21->40-1.1
BAREF  (1 unrouted)
BMISO  (2 unrouted)
BMOSI  (2 unrouted)
BRESET  (5 unrouted)
BRXD  (2 unrouted)
BSCK  (2 unrouted)
BTXD  (2 unrouted)
BUSB_5V
  Bottom 0.406: 5.33,7.37 8.13,7.37 TJP6.1 | BJP10.3 1.52,34.29 0.64,33.4 0.64,9.02 2.29,7.37
  Bottom 0.813: 2.29,7.37 5.33,7.37
BVCC  (6 unrouted)
BVIN  (1 unrouted)
  Bottom 1.27: TD1.A 88.9,44.45 88.9,35.26
BVIN_SAFE
  Bottom 0.406: 80.9,43.69 TC7.+ | 80.9,43.69 TC4.1 84.84,43.31 86.74,41.4 86.74,40.13 | TD1.C 80.77,43.81 80.9,43.69
  Bottom 0.813: 86.74,40.13 86.74,30.61 89.15,28.19
  Bottom 1.27: 89.15,28.19 91.69,25.65 95.5,25.65 96.52,24.64 TVREG.IN
BVREG-OUT
  Bottom 0.406: 89.15,4.45 86.87,4.45 TC5.1 84.45,4.19 81.66,1.4 9.78,1.4 TJP6.3
  Bottom 0.813: 89.15,4.45 90.3,4.45 96.52,10.67
  Bottom 1.016: 90.3,4.45 TC6.+
  Bottom 1.27: 96.52,10.67 TVREG.OUT
BXTAL2  (2 unrouted)
GND  (4 unrouted)
  Bottom 0.254: 55.88,21.34 55.88,5.33
  Bottom 0.305: 7.87,3.94 9.14,3.94 | 43.18,5.59 43.18,22.35
  Bottom 0.406: BC1.1 81.92,11.18 76.2,11.18 74.17,9.14 74.17,5.33 73.66,4.83 56.39,4.83 55.88,5.33 | 55.88,21.34 52.83,24.38 45.21,24.38 43.18,22.35 | BJP10.2 2.54,39.12 BJP10.1 2.79,41.02 0.51,43.31 0.51,46.1 2.29,47.88 45.97,47.88 46.86,46.99 B644-SJ8-AGND.1 47.24,47.24 74.42,47.24 | 43.18,5.59 42.42,4.83 23.11,4.83 21.59,6.35 21.59,8.13 20.32,9.4 10.54,9.4 5.97,13.97 BSV1.6 | 7.87,3.94 7.49,3.94 7.11,3.56 7.11,1.4 7.75,0.76 83.44,0.76 TC5.2 | 9.14,3.94 11.63,3.94 BS1.3 BS1.4 | TXTAL.2 81.15,6.86 TC2.1 | 92.08,1.91 92.08,1.65 93.22,0.51 97.03,0.51 98.55,2.03 98.55,15.88 97.41,17.02 97.16,17.02 | TVREG.GND 97.16,17.02 | 97.16,17.02 98.3,18.16 98.3,31.56 TCON.RING 98.42,36.95 98.42,46.1 96.77,47.75 89.92,47.75 86.36,44.2 86.36,44.07 | 86.36,44.07 TC4.2 | TC7.- 78.23,47.75 82.68,47.75 86.36,44.07
  Bottom 0.813: 92.08,1.91 84.58,1.91 | TVREG.GND 94.49,14.99 94.49,10.92 92.96,9.4 BC1.1 83.69,9.14 TC2.1 | TC4.2 86.36,43.43 | 74.42,47.24 75.69,47.24 TC7.-
  pour Bottom (isolate 0.254): 0,48.26 0,0 99.06,0 99.06,48.26
MISO1
  Bottom 0.406: 6.35,21.59 6.6,21.59 6.99,21.97 6.99,23.11 8.13,24.26
  Bottom 0.61: 6.35,21.59 4.95,21.59 3.43,20.07
MOSI1
  Bottom 0.406: 6.86,17.53 7.24,17.53 8.89,19.18 8.89,22.23
  Bottom 0.813: 6.86,17.53 5.97,17.53
N$11  (2 unrouted)
N$12  (2 unrouted)
N$14  (2 unrouted)
N$15  (2 unrouted)
N$21  (2 unrouted)
N$22  (2 unrouted)
N$23  (2 unrouted)
N$24  (2 unrouted)
N$25  (2 unrouted)
N$26  (2 unrouted)
N$27  (2 unrouted)
N$28  (2 unrouted)
N$29  (2 unrouted)
N$31  (2 unrouted)
N$32  (2 unrouted)
N$33  (2 unrouted)
RESET1
  Bottom 0.406: 24.13,3.05 41.53,3.05 | 23.75,3.3 18.95,8.1 10.95,8.1 8.13,10.92 4.06,10.92 3.43,11.56 3.43,14.99 | 42.55,3.05 42.8,3.05 43.31,3.56
  Bottom 0.61: 23.75,3.3 23.88,3.3 24.13,3.05 | 41.53,3.05 42.55,3.05
RXD1
  Bottom 0.254: 57.15,24.51 57.15,24.77 56.26,25.65 24.64,25.65 22.35,27.94 22.35,45.85 21.46,46.74 8,46.74 7.49,46.23 7.49,40.89
  Bottom 0.305: 2.03,27.94 6.6,27.94
  Bottom 0.406: 2.03,27.94 1.27,28.7 1.27,30.48 2.54,31.75 | 6.6,27.94 8,29.34 8,40.39 7.49,40.89
SCK1
  Bottom 0.406: 4.19,22.99 7.37,26.16 8.89,26.16
  Bottom 0.61: 4.19,22.99 1.91,20.7 1.91,19.05 3.43,17.53
T644P6
  Bottom 0.406: U$2.25 36.83,23.11 36.32,23.62 11.3,23.62 10.67,22.99
T644P7
  Bottom 0.406: U$2.24 39.37,23.62 38.73,24.26
T644P12  (1 unrouted)
T644P13  (1 unrouted)
T644P14  (1 unrouted)
T644P31  (1 unrouted)
T644P36  (1 unrouted)
T644P37  (1 unrouted)
TGND  (7 unrouted)
  pour Top: -0.13,0.38 -0.13,48.26 99.31,48.26 99.31,0 0.89,-0.13
TUSB_5V  (1 unrouted)
TVCC  (1 unrouted)
TVIN  (1 unrouted)
TVIN_SAFE  (3 unrouted)
TXD1
  Bottom 0.254: 59.69,24.51 59.69,25.53 59.05,26.16 24.77,26.16 22.86,28.07 22.86,46.74 22.35,47.24 7.49,47.24 6.99,46.74 6.99,40.64
  Bottom 0.406: 6.99,40.64 6.99,40.39 7.37,40.01 7.37,30.73
TXTAL1  (2 unrouted)
TXTAL2  (2 unrouted)
VCC1
  Bottom 0.406: 10.03,6.35 9.65,6.35 8.51,5.21 | 9.91,6.6 9.91,8.26 8.76,9.4 3.17,9.4 2.16,10.41 2.16,13.34 | 18.8,6.35 19.05,6.35 19.43,5.97 19.43,5.08 22.48,2.03 46.35,2.03 46.99,2.67
  Bottom 0.61: 2.16,13.34 2.16,15.62 2.79,16.26 4.45,16.26 4.7,16.51 4.7,18.8 5.97,20.07 | 46.99,2.67 46.61,2.29 | 18.8,6.35 10.03,6.35 10.03,6.48 9.91,6.6
VIN1
  Bottom 0.406: 89.15,36.32 89.15,34.81 89.77,34.19
  Bottom 1.27: 89.15,36.32 89.15,43.94
VREG-OUT2  (3 unrouted)
XTAL2  (1 unrouted)
XTAL3
  Bottom 0.61: 77.72,4.32 77.72,2.79 77.22,2.29 52.45,2.29 52.07,2.67
  Bottom 0.813: 77.72,4.32 81.15,4.32 81.28,4.19
XTAL4
  Bottom 0.406: 56.39,3.05 56.26,3.05 55.75,3.56
  Bottom 0.61: 56.39,3.05 75.18,3.05 75.69,3.56 75.69,8.89 76.2,9.4 77.72,9.4 | 55.75,3.56 55.88,3.43
  Bottom 0.813: 77.72,9.4 81.15,9.4

### Text on the board
tPlace: EXT | USB | GRN | SDA | SCL | PWM | autoreset | enable | A0 | A1 | A2 | A3 | A4 | A5 | A6 | A7 | Aref | GND | 5V | 23 | 22 | 21 | 20 | 19 | 18 | 17 | 16 | 15 | PWM | VIN | ICSP | BLK | 8 | 9 | RX2 | TX2 | PWM | PWM | PWM | 0 | 1 | 2 | 3 | 4 | 5 | 6 | 7 | Reset | 5V | GND | Rx | Tx | 10 | 11 | 12 | 13 | 14 | VIN | SAFE | RESET